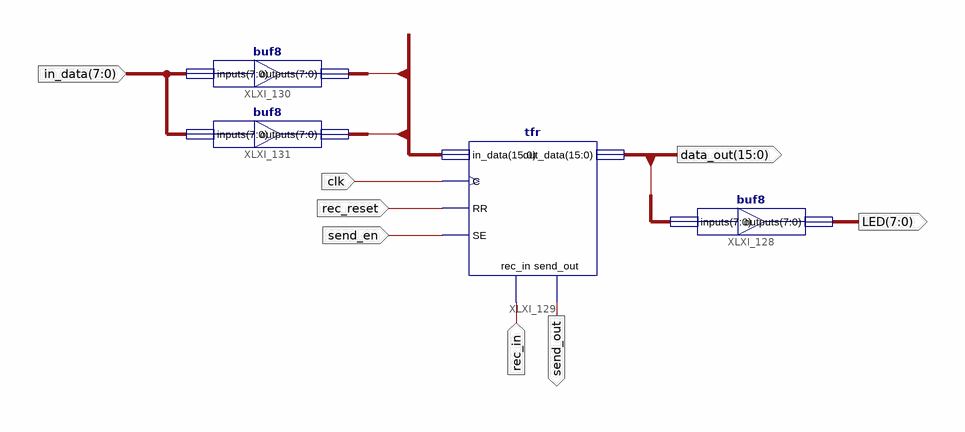
[diagram p0: schematic sheet 1]
// Xilinx ISE schematic mainproj.sch (spartan6) as structural Verilog: 4 symbols, 8 ports
module mainproj (
  input  send_en,
  input  rec_in,
  input  rec_reset,
  input  clk,
  input  [7:0] in_data,
  output send_out,
  output [15:0] data_out,
  output [7:0] LED
);

  wire [15:0] tfr_data;

  buf8 XLXI_128 (.inputs(data_out[7:0]), .outputs(LED));
  tfr XLXI_129 (
    .in_data(tfr_data), .C(clk), .RR(rec_reset), .SE(send_en), .rec_in(rec_in), .send_out(send_out),
    .out_data(data_out));
  buf8 XLXI_130 (.inputs(in_data), .outputs(tfr_data[15:8]));
  buf8 XLXI_131 (.inputs(in_data), .outputs(tfr_data[7:0]));
endmodule
